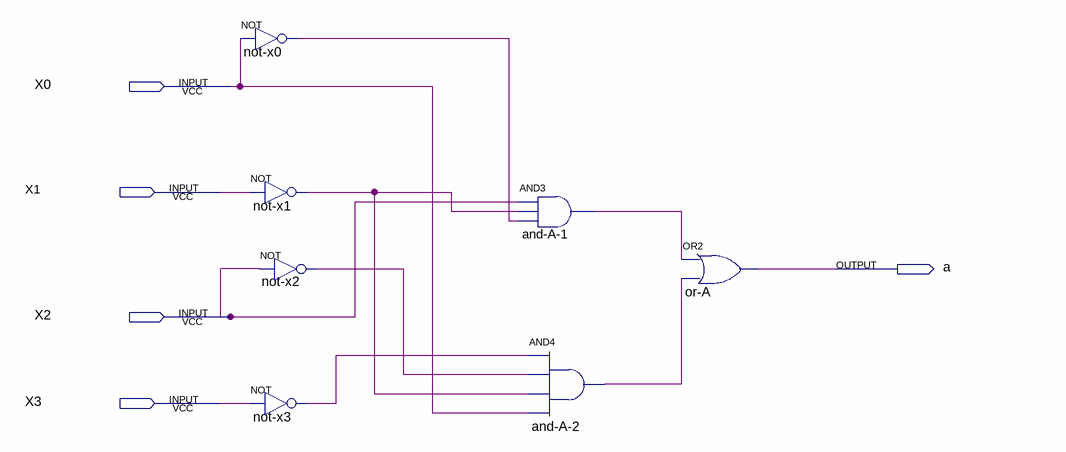
[diagram p0: schematic sheet]
// Quartus schematic dec_segmento_A.bdf as structural Verilog: 7 symbols, 5 pins
module dec_segmento_A (
  input  X0,
  input  X1,
  input  X2,
  input  X3,
  output a
);

  wire and_A_1_out, and_A_2_out, not_x0_out, not_x1_out, not_x2_out, not_x3_out;

  not \not-x0  (not_x0_out, X0);
  not \not-x1  (not_x1_out, X1);
  not \not-x2  (not_x2_out, X2);
  not \not-x3  (not_x3_out, X3);
  and \and-A-1  (and_A_1_out, X2, not_x1_out, not_x0_out);
  and \and-A-2  (and_A_2_out, not_x3_out, not_x2_out, not_x1_out, X0);
  or \or-A  (a, and_A_1_out, and_A_2_out);
endmodule
